# EAGLE schematic LilyPad_White_5pcs_v02 (EAGLE 7.5.0)
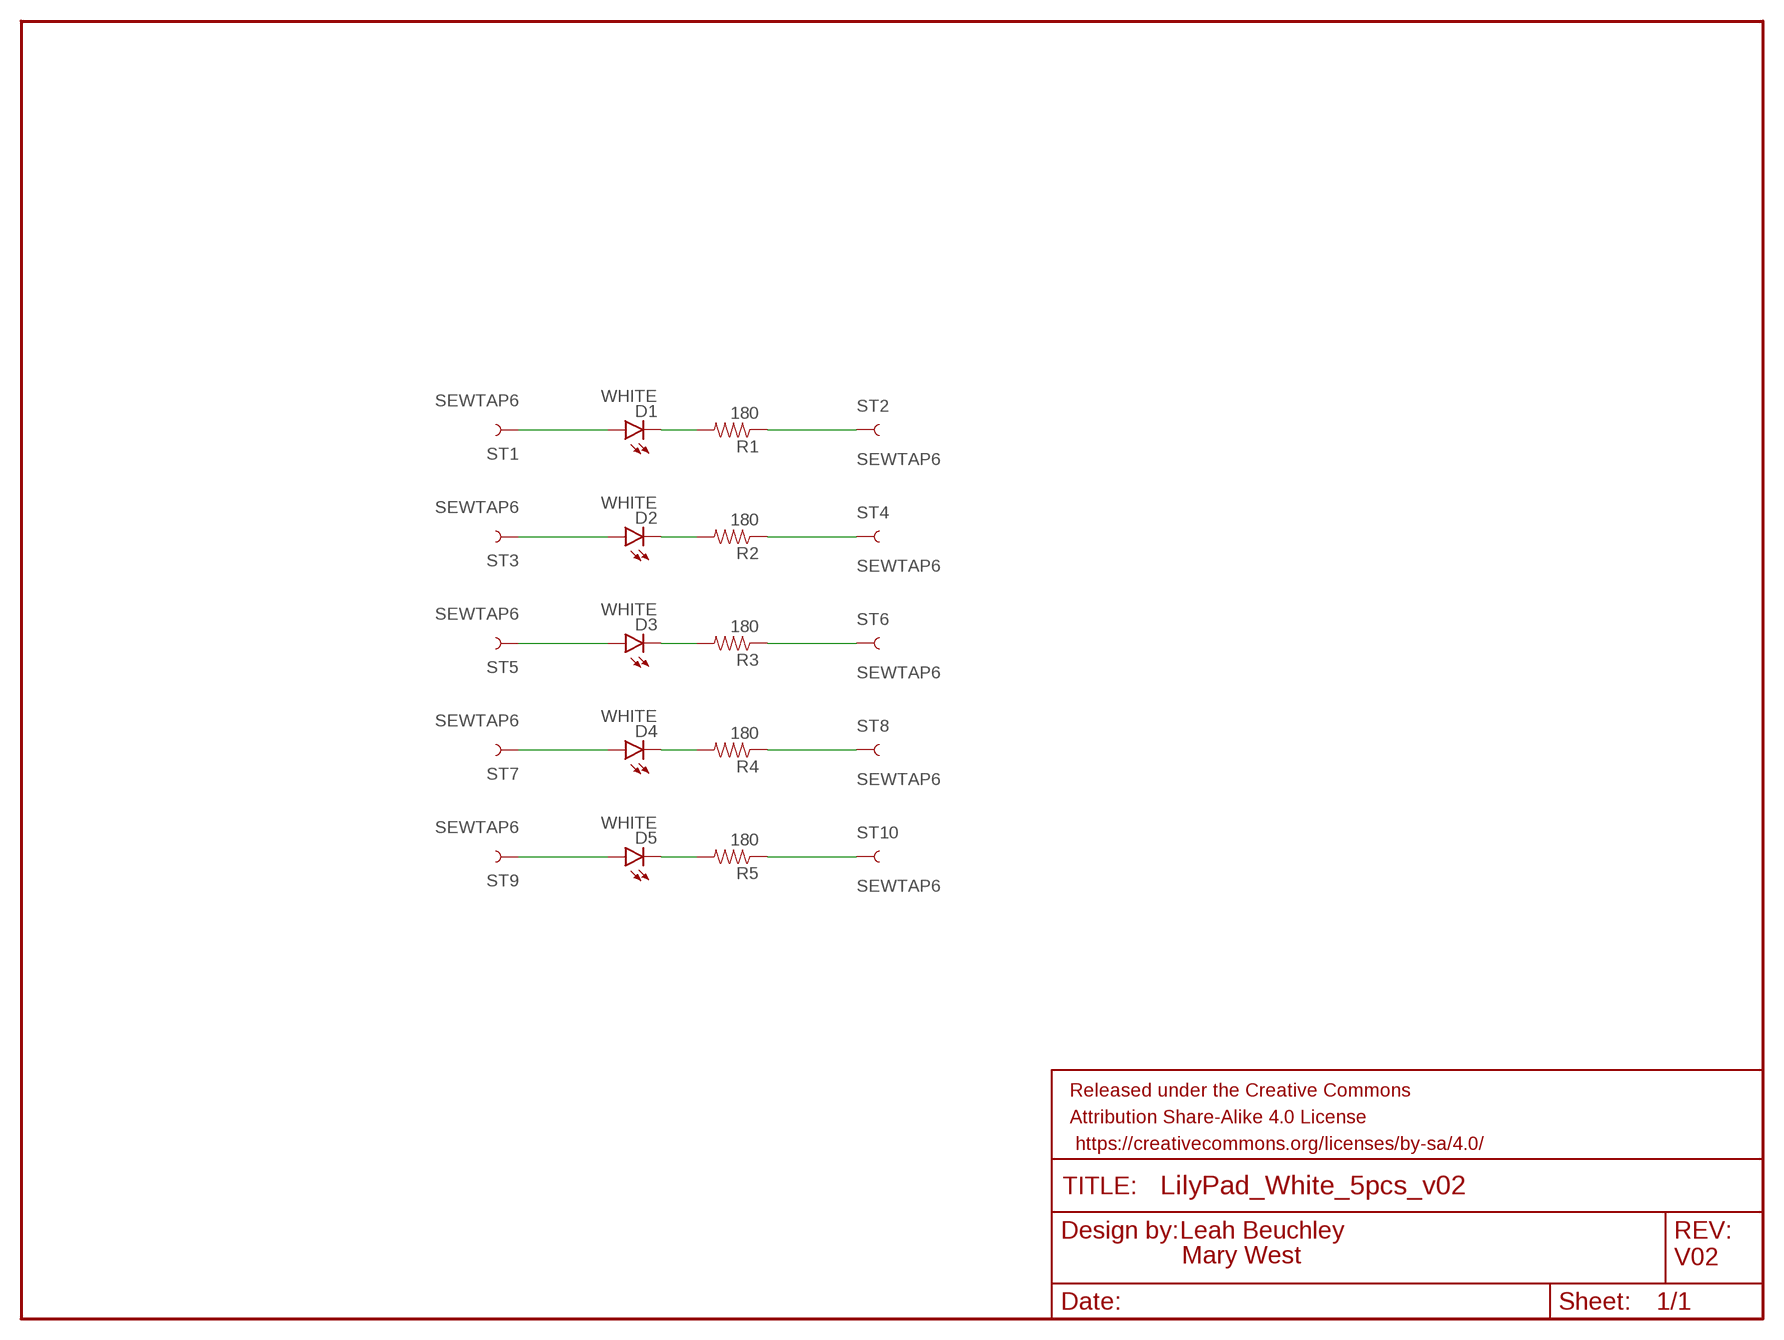
[diagram p0: schematic, sheet 1]

## Parts
D1  WHITE  LED-WHITE1206  [LED-1206]
D2  WHITE  LED-WHITE1206  [LED-1206]
D3  WHITE  LED-WHITE1206  [LED-1206]
D4  WHITE  LED-WHITE1206  [LED-1206]
D5  WHITE  LED-WHITE1206  [LED-1206]
FRAME1  FRAME-LETTER  [CREATIVE_COMMONS]
R1  180  180OHM1/10W1%(0603)  [0603-RES]
R2  180  180OHM1/10W1%(0603)  [0603-RES]
R3  180  180OHM1/10W1%(0603)  [0603-RES]
R4  180  180OHM1/10W1%(0603)  [0603-RES]
R5  180  180OHM1/10W1%(0603)  [0603-RES]
ST1  SEWTAP6  [PETAL-SMALL-2SIDE]
ST2  SEWTAP6  [PETAL-SMALL-2SIDE]
ST3  SEWTAP6  [PETAL-SMALL-2SIDE]
ST4  SEWTAP6  [PETAL-SMALL-2SIDE]
ST5  SEWTAP6  [PETAL-SMALL-2SIDE]
ST6  SEWTAP6  [PETAL-SMALL-2SIDE]
ST7  SEWTAP6  [PETAL-SMALL-2SIDE]
ST8  SEWTAP6  [PETAL-SMALL-2SIDE]
ST9  SEWTAP6  [PETAL-SMALL-2SIDE]
ST10  SEWTAP6  [PETAL-SMALL-2SIDE]

## Nets
N$1: R1.1 ST2.1
N$2: D1.A ST1.1
N$3: D1.C R1.2
N$4: D2.A ST3.1
N$5: D2.C R2.2
N$6: R2.1 ST4.1
N$7: D3.A ST5.1
N$8: D3.C R3.2
N$9: R3.1 ST6.1
N$10: R4.1 ST8.1
N$11: D4.C R4.2
N$12: D4.A ST7.1
N$13: D5.A ST9.1
N$14: D5.C R5.2
N$15: R5.1 ST10.1

## Notes on the sheet
- Leah Beuchley
- Mary West | V02

## Library data of the parts
D1-D5 = SparkFun-LED:LED-WHITE: White SMD LEDs LilyPad 1206- DIO-09955; PROD_ID: DIO-09955
FRAME1 = SparkFun-Aesthetics:FRAME-LETTER: Schematic Frame Standard 8.5x11 US Letter frame
R1-R5 = SparkFun-Resistors:180OHM1/10W1%(0603): RES-08788; PROD_ID: RES-08788
ST1-ST10 = LilyPad-Wearables:SEWTAP: Sew Taps for LilyPad Boards.